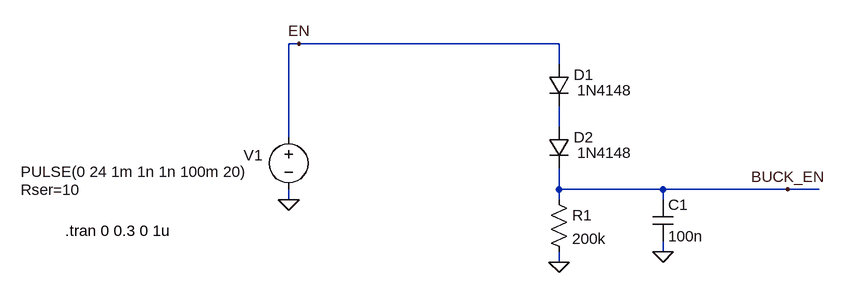
[diagram p0: schematic buck_en.asc]
buck_en.asc, the LTspice schematic file:
Version 4
SHEET 1 1032 680
WIRE 128 -48 112 -48
WIRE 528 -48 128 -48
WIRE 528 -16 528 -48
WIRE 528 80 528 48
WIRE 112 96 112 -48
WIRE 528 176 528 144
WIRE 688 176 528 176
WIRE 880 176 688 176
WIRE 928 176 880 176
WIRE 112 192 112 176
WIRE 528 192 528 176
WIRE 688 192 688 176
WIRE 688 272 688 256
WIRE 528 288 528 272
FLAG 112 192 0
FLAG 128 -48 EN
FLAG 528 288 0
FLAG 688 272 0
FLAG 880 176 BUCK_EN
SYMBOL voltage 112 80 R0
WINDOW 0 -69 44 Left 2
WINDOW 3 -412 69 Left 2
WINDOW 123 0 0 Left 0
WINDOW 39 -412 97 Left 2
SYMATTR InstName V1
SYMATTR Value PULSE(0 24 1m 1n 1n 100m 20)
SYMATTR SpiceLine Rser=10
SYMBOL res 512 176 R0
SYMATTR InstName R1
SYMATTR Value 200k
SYMBOL diode 512 -16 R0
WINDOW 0 39 16 Left 2
WINDOW 3 44 40 Left 2
SYMATTR InstName D1
SYMATTR Value 1N4148
SYMBOL cap 672 192 R0
SYMATTR InstName C1
SYMATTR Value 100n
SYMBOL diode 512 80 R0
WINDOW 0 39 16 Left 2
WINDOW 3 44 40 Left 2
SYMATTR InstName D2
SYMATTR Value 1N4148
TEXT -232 240 Left 2 !.tran 0 0.3 0 1u

The netlist it stands for:
* buck_en.asc
V1 EN 0 PULSE(0 24 1m 1n 1n 100m 20) Rser=10
R1 BUCK_EN 0 200k
D1 EN N001 1N4148
C1 BUCK_EN 0 100n
D2 N001 BUCK_EN 1N4148
.model D D
.lib standard.dio
.tran 0 0.3 0 1u
.backanno
.end